# Altium schematic sheet WiredRemoteController.SchDoc
size A4
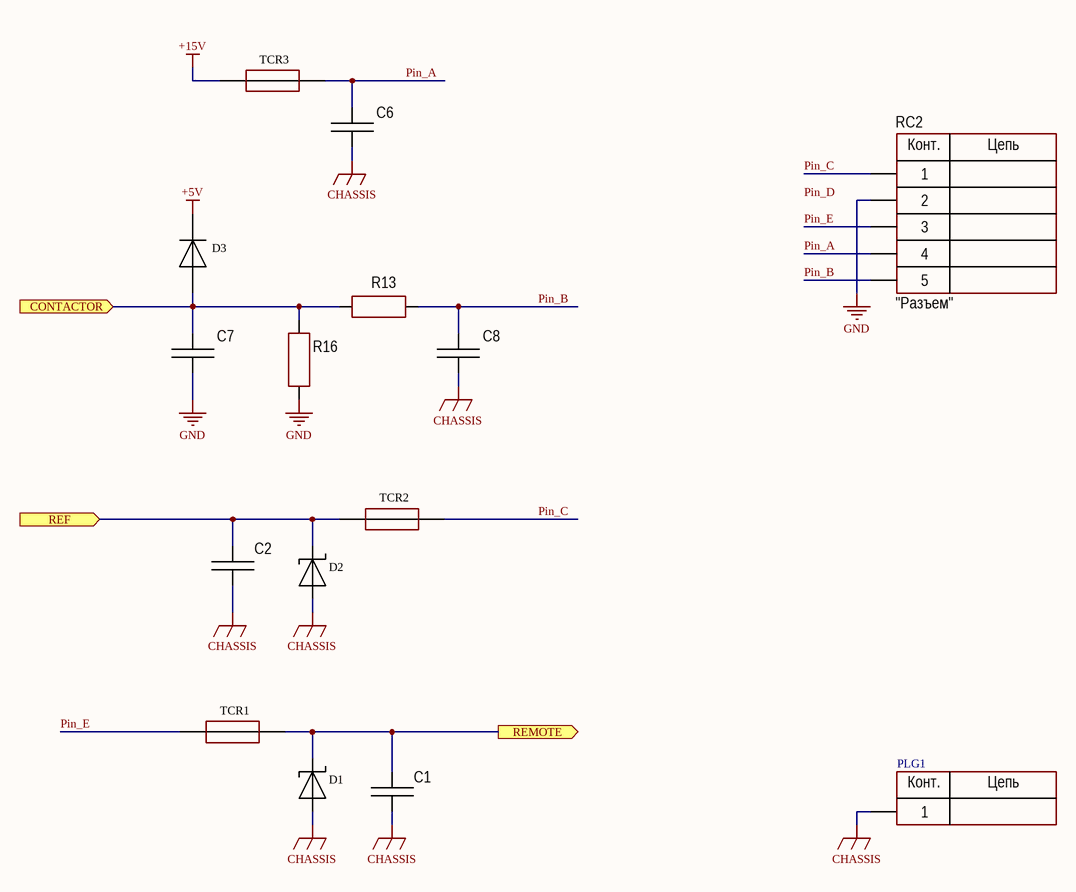
[diagram p0: WiredRemoteController.SchDoc]

## Parts
C1  (no value)  [CAPC4564X22M]
C2  (no value)  [CAPC4564X22M]
C6  (no value)  [CAPC4564X22M]
C7  (no value)  [CAP: 1206]
C8  (no value)  [CAPC4564X22M]
D1  (no value)  [DIODE: SMC]
D2  (no value)  [DIODE: SMC]
D3  (no value)  [SOT23]
PLG1  PLG1  [PLG1]  (value not drawn)  (no BOM)
R13  (no value)  [RES: 1206]
R16  (no value)  [RES: 1206]
RC2  CommentText: "Разъем"  [MOLEX 39-30-3056]
TCR1  (no value)  [TRF250-120T-B-0.5]
TCR2  (no value)  [TRF250-120T-B-0.5]
TCR3  (no value)  [TRF250-120T-B-0.5]

## Ports
CONTACTOR (in), REF (in), REMOTE (out)

## Nets
+5V: D3.3
+15V: TCR3.1
CHASSIS: C1.1 C2.1 C6.1 C8.1 D1.1(A) D2.1(A) PLG1.1
GND: C7.1 R16.1 RC2.2
CONTACTOR: C7.2 D3.1 R13.2 R16.2 ; port CONTACTOR
Pin_A: C6.2 RC2.4 TCR3.2
Pin_B: C8.2 R13.1 RC2.5
Pin_C: RC2.1 TCR2.2
Pin_E: RC2.3 TCR1.2
REF: C2.2 D2.2(C) TCR2.1 ; port REF
REMOTE: C1.2 D1.2(C) TCR1.1 ; port REMOTE

## Notes on the sheet
- Labels drawn without touching a wire or pin: Pin_D
- (in symbol PBS-5) Конт.; Цепь
- (in symbol PLG1) Конт.; Цепь

## Library data of the parts
C1 C2 C6 C8 = Ceramic_1206: Manufacturer: Yageo; PartNumber: CC1206KRX7R9BB104; ValueManufacturerPartNumber: Ceramic capacitor, 0.1μF, 1825; TypeCapacitor: Ceramic capacitor; Tolerance: ±10%; TypeDielectric: X7R; Voltage: 630V; Value: 0.1μF; Package: 1825; HelpURL: https://www.digikey.com/product-detail/en/yageo/CC1206KRX7R9BB104/311-1179-1-ND/303089; Temperature: -55...+125°C
C7 = Ceramic_1206: Manufacturer: Yageo; PartNumber: CC1206KRX7R9BB104; ValueManufacturerPartNumber: Ceramic capacitor, 0.1μF, 1206; TypeCapacitor: Ceramic capacitor; Tolerance: ±10%; TypeDielectric: X7R; Voltage: 50V; Value: 0.1μF; Package: 1206; HelpURL: https://www.digikey.com/product-detail/en/yageo/CC1206KRX7R9BB104/311-1179-1-ND/303089; Temperature: -55...+125°C
D1 D2 = SMCJ15A: ValueManufacturerPartNumber: SMCJ15A, SMC; Package: SMC; PartNumber: SMCJ15A
D3 = MMBD4148: ValueManufacturerPartNumber: MMBD4148, SOT23; Package: SOT23; PartNumber: MMBD4148
R13 = Resistor_1206: Manufacturer: Yageo; PartNumber: RC1206JR-07100RL; ValueManufacturerPartNumber: Resistor, 10K, 1206; Power: 0.25W; Tolerance: ±5%; Value: 10K; Package: 1206; HelpURL: https://www.digikey.com/product-detail/en/yageo/RC1206JR-07100RL/311-100ERCT-ND/732153; Temperature: -55...+125°C; TypeResistor: Resistor
R16 = Resistor_1206: Manufacturer: Yageo; PartNumber: RC1206JR-07100RL; ValueManufacturerPartNumber: Resistor, 4.99K, 1206; Power: 0.25W; Tolerance: ±5%; Value: 4.99K; Package: 1206; HelpURL: https://www.digikey.com/product-detail/en/yageo/RC1206JR-07100RL/311-100ERCT-ND/732153; Temperature: -55...+125°C; TypeResistor: Resistor
RC2 = PBS-5: Manufacturer: MOLEX; ValueManufacturerPartNumber: Connector, MOLEX, 39-30-3056, 5pin; TypeConnector: Connector; VoltageMax: 500VAC; Pitch: 2.54mm; CurrentMax: 3A; Multichannel: 5pin; HelpURL: https://www.chipdip.ru/product/pbs-5; PartNumber: 39-30-3056
TCR1-TCR3 = TRF250-120T-B-0.5: ValueManufacturerPartNumber: TRF250-120T-B-0.5; PartNumber: TRF250-120T-B-0.5